# EAGLE design RP2350A_Logic_Analyzer (EAGLE 9.2.1)
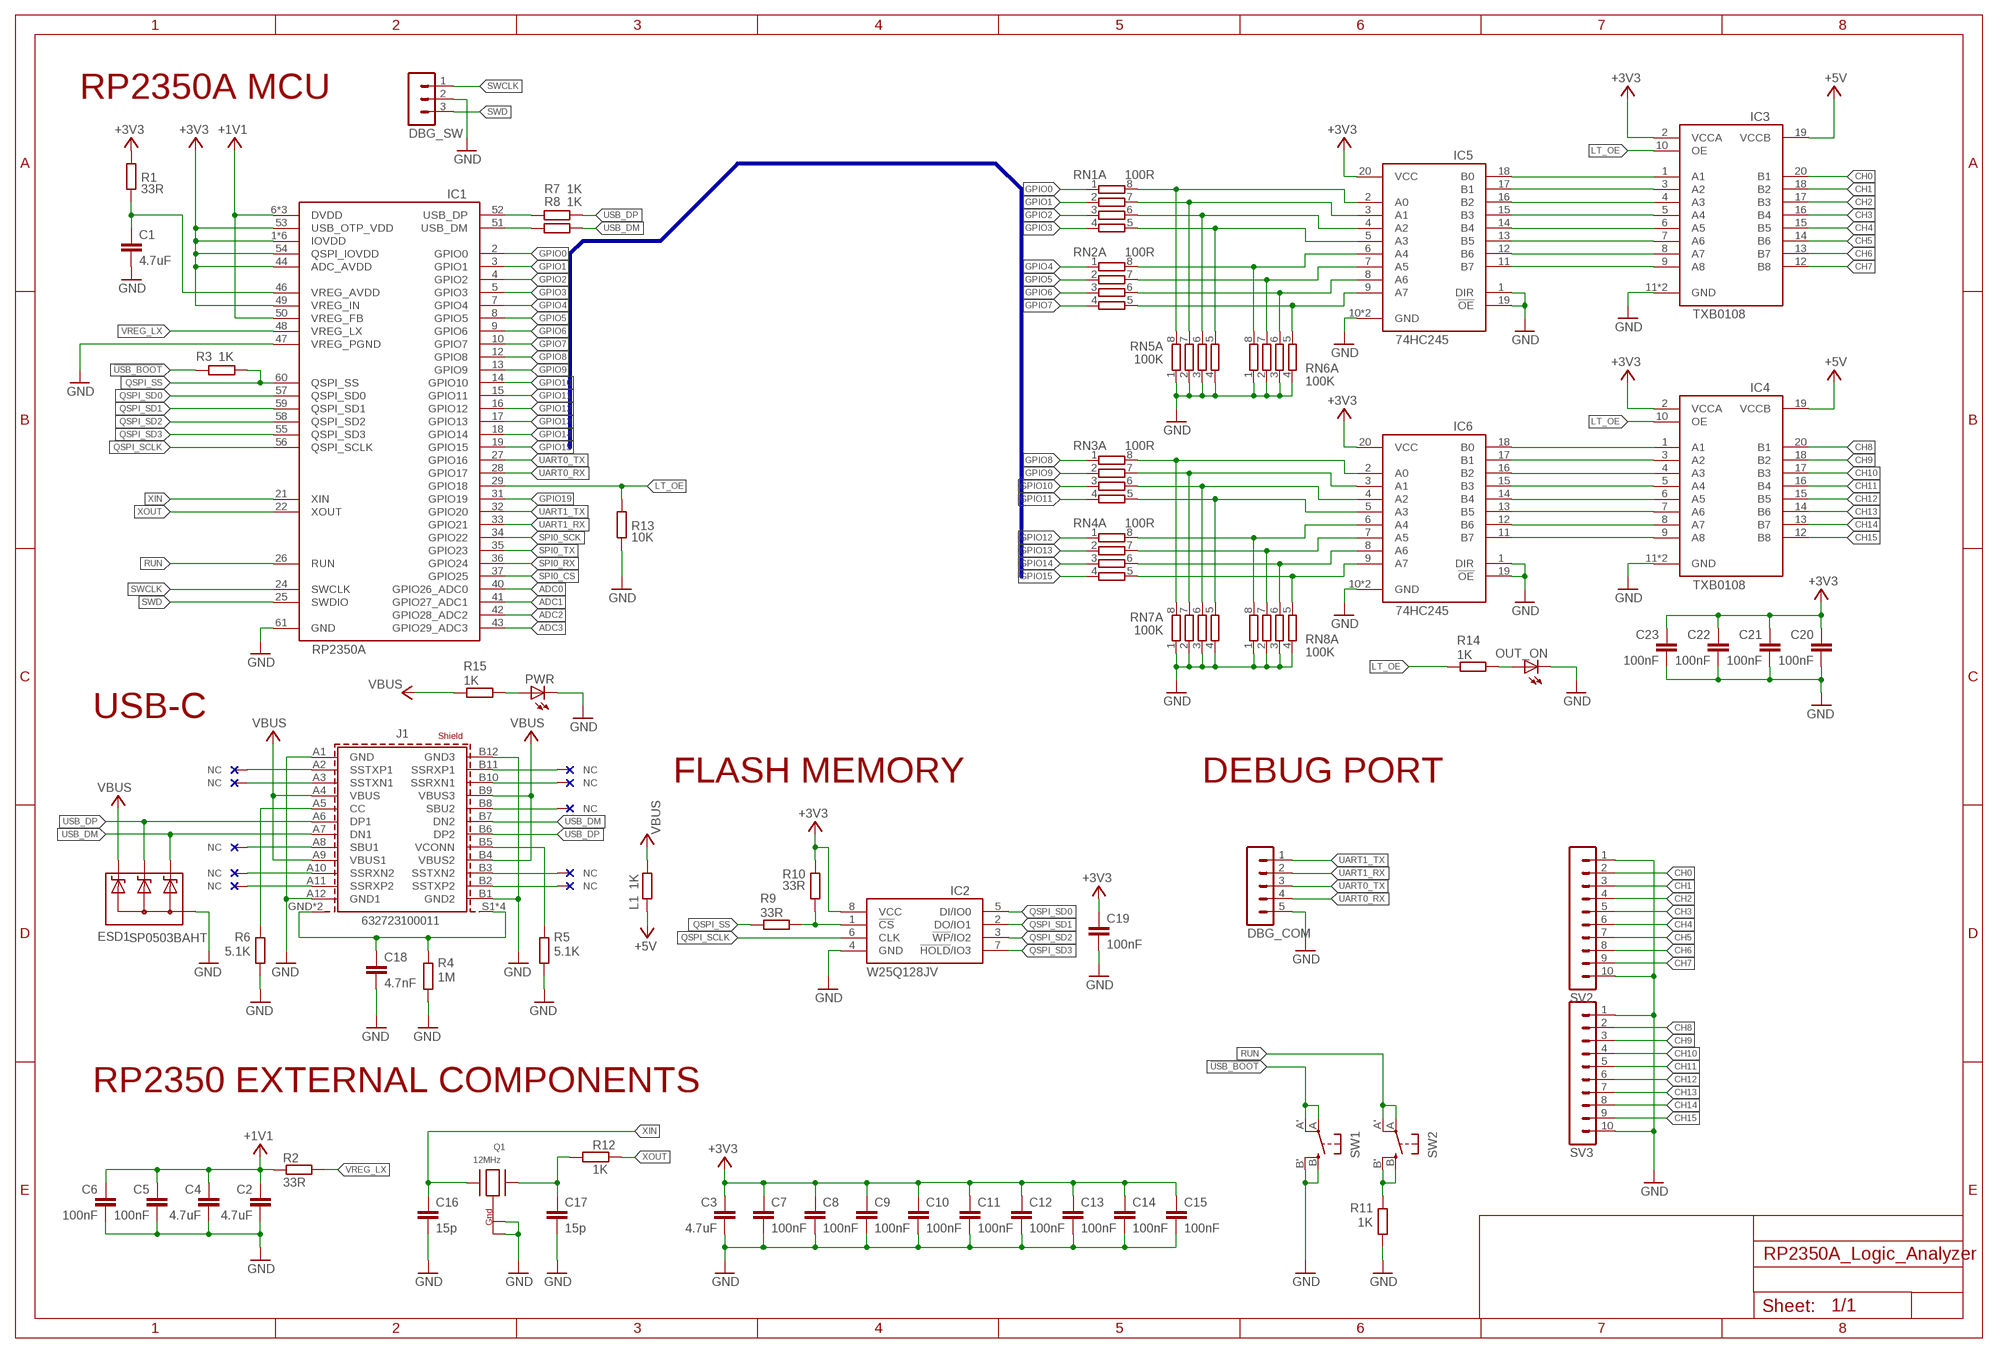
[diagram p0: schematic, sheet 1]

## Parts
C1  4.7uF  C-EUC0402  [C0402]
C2  4.7uF  C-EUC0402  [C0402]
C3  4.7uF  C-EUC0402  [C0402]
C4  4.7uF  C-EUC0402  [C0402]
C5  100nF  C-EUC0402  [C0402]
C6  100nF  C-EUC0402  [C0402]
C7  100nF  C-EUC0402  [C0402]
C8  100nF  C-EUC0402  [C0402]
C9  100nF  C-EUC0402  [C0402]
C10  100nF  C-EUC0402  [C0402]
C11  100nF  C-EUC0402  [C0402]
C12  100nF  C-EUC0402  [C0402]
C13  100nF  C-EUC0402  [C0402]
C14  100nF  C-EUC0402  [C0402]
C15  100nF  C-EUC0402  [C0402]
C16  15p  C-EUC0402  [C0402]
C17  15p  C-EUC0402  [C0402]
C18  4.7nF  C-EUC0402  [C0402]
C19  100nF  C-EUC0402  [C0402]
C20  100nF  C-EUC0402  [C0402]
C21  100nF  C-EUC0402  [C0402]
C22  100nF  C-EUC0402  [C0402]
C23  100nF  C-EUC0402  [C0402]
DBG_COM  MA05-1  [MA05-1]
DBG_SW  MA03-1  [MA03-1]
ESD1  SP0503BAHT  [SOT143]
IC1  RP2350AA  [QFN40P700X700X85-61T340N]
IC2  W25Q128JVP  [SON127P600X500X75-8N]
IC3  TXB0108RGY  [QFN50P350X450X100-25T200X300N]
IC4  TXB0108RGY  [QFN50P350X450X100-25T200X300N]
IC5  74HC245BQ  [QFN50P250X450X90-21T100X300N]
IC6  74HC245BQ  [QFN50P250X450X90-21T100X300N]
J1  632723100011  632723100011  [632723100011]
L1  1K  R-EU_R0402  [R0402]
OUT_ON  LEDCHIPLED_0603  [CHIPLED_0603]
PWR  LEDCHIPLED_0603  [CHIPLED_0603]
Q1  12MHz  XTAL-4-3225  [NX3225]
R1  33R  R-EU_R0402  [R0402]
R2  33R  R-EU_R0402  [R0402]
R3  1K  R-EU_R0402  [R0402]
R4  1M  R-EU_R0402  [R0402]
R5  5.1K  R-EU_R0402  [R0402]
R6  5.1K  R-EU_R0402  [R0402]
R7  1K  R-EU_R0402  [R0402]
R8  1K  R-EU_R0402  [R0402]
R9  33R  R-EU_R0402  [R0402]
R10  33R  R-EU_R0402  [R0402]
R11  1K  R-EU_R0402  [R0402]
R12  1K  R-EU_R0402  [R0402]
R13  10K  R-EU_R0402  [R0402]
R14  1K  R-EU_R0402  [R0402]
R15  1K  R-EU_R0402  [R0402]
RN1  100R  4R-N0603-ARC  [0603-ARC]
RN2  100R  4R-N0603-ARC  [0603-ARC]
RN3  100R  4R-N0603-ARC  [0603-ARC]
RN4  100R  4R-N0603-ARC  [0603-ARC]
RN5  100K  4R-N0603-ARC  [0603-ARC]
RN6  100K  4R-N0603-ARC  [0603-ARC]
RN7  100K  4R-N0603-ARC  [0603-ARC]
RN8  100K  4R-N0603-ARC  [0603-ARC]
SV2  MA10-1  [MA10-1]
SV3  MA10-1  [MA10-1]
SW1  SPST_TACT-EVQQ2  [EVQ-Q2]
SW2  SPST_TACT-EVQQ2  [EVQ-Q2]

## Nets
!USB_BOOT: R3.1 SW1.A'(P1) SW1.A(P)
+1V1: C2.1 C4.1 C5.1 C6.1 IC1.6(DVDD) IC1.23(DVDD) IC1.39(DVDD) IC1.50(VREG_FB) R2.2
+3V3: C3.1 C7.1 C8.1 C9.1 C10.1 C11.1 C12.1 C13.1 C14.1 C15.1 C19.1 C20.1 C21.1 C22.1 C23.1 IC1.1(IOVDD) IC1.11(IOVDD) IC1.20(IOVDD) IC1.30(IOVDD) IC1.38(IOVDD) IC1.44(ADC_AVDD) IC1.45(IOVDD) IC1.49(VREG_IN) IC1.53(USB_OTP_VDD) IC1.54(QSPI_IOVDD) IC2.8(VCC) IC3.2(VCCA) IC4.2(VCCA) IC5.20(VCC) IC6.20(VCC) R1.1 R10.1
+5V: IC3.19(VCCB) IC4.19(VCCB) L1.1
ADC0: IC1.40(GPIO26_ADC0)
ADC1: IC1.41(GPIO27_ADC1)
ADC2: IC1.42(GPIO28_ADC2)
ADC3: IC1.43(GPIO29_ADC3)
CH0: IC3.20(B1) SV2.2
CH1: IC3.18(B2) SV2.3
CH2: IC3.17(B3) SV2.4
CH3: IC3.16(B4) SV2.5
CH4: IC3.15(B5) SV2.6
CH5: IC3.14(B6) SV2.7
CH6: IC3.13(B7) SV2.8
CH7: IC3.12(B8) SV2.9
CH8: IC4.20(B1) SV3.2
CH9: IC4.18(B2) SV3.3
CH10: IC4.17(B3) SV3.4
CH11: IC4.16(B4) SV3.5
CH12: IC4.15(B5) SV3.6
CH13: IC4.14(B6) SV3.7
CH14: IC4.13(B7) SV3.8
CH15: IC4.12(B8) SV3.9
DM [DIFFPAIR]: IC1.51(USB_DM) R8.1
DP [DIFFPAIR]: IC1.52(USB_DP) R7.1
GND: C1.2 C2.2 C3.2 C4.2 C5.2 C6.2 C7.2 C8.2 C9.2 C10.2 C11.2 C12.2 C13.2 C14.2 C15.2 C16.2 C17.2 C18.2 C19.2 C20.2 C21.2 C22.2 C23.2 DBG_COM.5 DBG_SW.2 ESD1.1(A) IC1.47(VREG_PGND) IC1.61(GND) IC2.4(GND) IC3.11(GND) IC3.PAD(GND) IC4.11(GND) IC4.PAD(GND) IC5.1(DIR) IC5.10(GND) IC5.19(!OE) IC5.PAD(GND) IC6.1(DIR) IC6.10(GND) IC6.19(!OE) IC6.PAD(GND) J1.A1(GND) J1.A12(GND1) J1.B1(GND2) J1.B12(GND3) OUT_ON.C PWR.C Q1.2(G2) Q1.4(G1) R4.1 R5.1 R6.1 R11.1 R13.2 RN5.1 RN5.2 RN5.3 RN5.4 RN6.1 RN6.2 RN6.3 RN6.4 RN7.1 RN7.2 RN7.3 RN7.4 RN8.1 RN8.2 RN8.3 RN8.4 SV2.1 SV2.10 SV3.1 SV3.10 SW1.B'(S1) SW1.B(S)
GPIO0: IC1.2(GPIO0) RN1.1
GPIO1: IC1.3(GPIO1) RN1.2
GPIO2: IC1.4(GPIO2) RN1.3
GPIO3: IC1.5(GPIO3) RN1.4
GPIO4: IC1.7(GPIO4) RN2.1
GPIO5: IC1.8(GPIO5) RN2.2
GPIO6: IC1.9(GPIO6) RN2.3
GPIO7: IC1.10(GPIO7) RN2.4
GPIO8: IC1.12(GPIO8) RN3.1
GPIO9: IC1.13(GPIO9) RN3.2
GPIO10: IC1.14(GPIO10) RN3.3
GPIO11: IC1.15(GPIO11) RN3.4
GPIO12: IC1.16(GPIO12) RN4.1
GPIO13: IC1.17(GPIO13) RN4.2
GPIO14: IC1.18(GPIO14) RN4.3
GPIO15: IC1.19(GPIO15) RN4.4
GPIO19: IC1.31(GPIO19)
LT_OE: IC1.29(GPIO18) IC3.10(OE) IC4.10(OE) R13.1 R14.1
N$1: C1.1 IC1.46(VREG_AVDD) R1.2
N$2: R11.2 SW2.B'(S1) SW2.B(S)
N$3: IC4.1(A1) IC6.18(B0)
N$4: J1.B8(SBU2)
N$5: J1.A5(CC) R6.2
N$6: J1.B5(VCONN) R5.2
N$7: C18.1 J1.GND1(SHIELD) J1.GND(SHIELD) J1.S1(SHIELD1) J1.S2(SHIELD1) J1.S3(SHIELD1) J1.S4(SHIELD1) R4.2
N$8: IC4.3(A2) IC6.17(B1)
N$9: J1.A2(SSTXP1)
N$10: J1.A3(SSTXN1)
N$11: J1.A10(SSRXN2)
N$12: J1.A11(SSRXP2)
N$13: J1.A8(SBU1)
N$14: IC4.4(A3) IC6.16(B2)
N$15: J1.B11(SSRXP1)
N$16: J1.B10(SSRXN1)
N$17: J1.B3(SSTXN2)
N$18: J1.B2(SSTXP2)
N$19: IC2.1(!CS) R9.2 R10.2
N$20: IC4.5(A4) IC6.15(B3)
N$21: IC4.6(A5) IC6.14(B4)
N$22: IC4.7(A6) IC6.13(B5)
N$23: IC4.8(A7) IC6.12(B6)
N$24: IC4.9(A8) IC6.11(B7)
N$25: IC3.1(A1) IC5.18(B0)
N$26: IC3.3(A2) IC5.17(B1)
N$27: IC3.4(A3) IC5.16(B2)
N$28: IC3.5(A4) IC5.15(B3)
N$29: IC3.6(A5) IC5.14(B4)
N$30: IC3.7(A6) IC5.13(B5)
N$31: IC3.8(A7) IC5.12(B6)
N$32: IC3.9(A8) IC5.11(B7)
N$33: IC5.2(A0) RN1.8 RN5.8
N$34: IC5.3(A1) RN1.7 RN5.7
N$35: IC5.4(A2) RN1.6 RN5.6
N$36: IC5.5(A3) RN1.5 RN5.5
N$37: IC5.6(A4) RN2.8 RN6.8
N$38: IC5.7(A5) RN2.7 RN6.7
N$39: IC5.8(A6) RN2.6 RN6.6
N$40: IC5.9(A7) RN2.5 RN6.5
N$41: IC6.2(A0) RN3.8 RN7.8
N$42: IC6.3(A1) RN3.7 RN7.7
N$43: IC6.4(A2) RN3.6 RN7.6
N$44: IC6.5(A3) RN3.5 RN7.5
N$45: IC6.6(A4) RN4.8 RN8.8
N$46: IC6.7(A5) RN4.7 RN8.7
N$47: IC6.8(A6) RN4.6 RN8.6
N$48: IC6.9(A7) RN4.5 RN8.5
N$49: OUT_ON.A R14.2
N$50: PWR.A R15.2
OU: C17.1 Q1.1(X1) R12.1
QSPI_SCLK [DIFFPAIR]: IC1.56(QSPI_SCLK) IC2.6(CLK)
QSPI_SD0 [DIFFPAIR]: IC1.57(QSPI_SD0) IC2.5(DI/IO0)
QSPI_SD1 [DIFFPAIR]: IC1.59(QSPI_SD1) IC2.2(DO/IO1)
QSPI_SD2 [DIFFPAIR]: IC1.58(QSPI_SD2) IC2.3(!WP!/IO2)
QSPI_SD3 [DIFFPAIR]: IC1.55(QSPI_SD3) IC2.7(!HOLD!/IO3)
QSPI_SS [DIFFPAIR]: IC1.60(QSPI_SS) R3.2 R9.1
RUN: IC1.26(RUN) SW2.A'(P1) SW2.A(P)
SPI0_CS: IC1.37(GPIO25)
SPI0_RX: IC1.36(GPIO24)
SPI0_SCK: IC1.34(GPIO22)
SPI0_TX: IC1.35(GPIO23)
SWCLK: DBG_SW.1 IC1.24(SWCLK)
SWD: DBG_SW.3 IC1.25(SWDIO)
UART0_RX: DBG_COM.4 IC1.28(GPIO17)
UART0_TX: DBG_COM.3 IC1.27(GPIO16)
UART1_RX: DBG_COM.2 IC1.33(GPIO21)
UART1_TX: DBG_COM.1 IC1.32(GPIO20)
USB_DM [DIFFPAIR]: ESD1.2(C1) J1.A7(DN1) J1.B7(DN2) R8.2
USB_DP [DIFFPAIR]: ESD1.3(C2) J1.A6(DP1) J1.B6(DP2) R7.2
VBUS: ESD1.4(C3) J1.A4(VBUS) J1.A9(VBUS1) J1.B4(VBUS2) J1.B9(VBUS3) L1.2 R15.1
VREG_LX: IC1.48(VREG_LX) R2.1
XIN: C16.1 IC1.21(XIN) Q1.3(X2)
XOUT: IC1.22(XOUT) R12.2

## Buses
GPIO0,GPIO1,GPIO2,GPIO3,GPIO4,GPIO5,GPIO6,GPIO7,GPIO8,GPIO9,GPIO10,GPIO11,GPIO12,GPIO13,GPIO14,GPIO15

## Notes on the sheet
- RP2350A MCU
- USB-C
- FLASH MEMORY | DEBUG PORT
- RP2350 EXTERNAL COMPONENTS

## Library data of the parts
C1-C23 = rcl:C-EU: CAPACITOR, European symbol
DBG_COM = con-lstb:MA05-1: PIN HEADER; OC_FARNELL: unknown; OC_NEWARK: unknown
DBG_SW = con-lstb:MA03-1: PIN HEADER; OC_FARNELL: unknown; OC_NEWARK: unknown
ESD1 = MCU:SP0503BAHT: TVS Diode Arrays Surface Mount TVS Avalanche Diode Array
IC1 = MCU:RP2350A: RP2350 is a new family of microcontrollers from Raspberry Pi that offers significant enhancements over RP2040. Key features include: • Dual Cortex-M33 or Hazard3 processors at 150 MHz • 520 kB on-chip SRAM, in 10 independent banks • 8 kB of one-time-programmable storage (OTP) • Up to 16 MB of external QSPI flash/PSRAM via dedicated QSPI bus - Additional 16 MB flash/PSRAM accessible via optional second chip-select • On-chip switched-mode power supply to generate core voltage - Low-quiescent-current LDO mode can be enabled for sleep states • 2× on-chip PLLs for internal or external clock generation • Security features: - Optional boot signing, enforced by on-chip mask ROM, with key fingerprint in OTP - Protected OTP storage for optional boot decryption key - Global bus filtering based on Arm or RISC-V security/privilege levels - Peripherals, GPIOs and DMA channels individually assignable to security domains - Hardware mitigations for fault injection attacks - Hardware SHA-256 accelerator • Peripherals: - 2× UARTs - 2× SPI controllers - 2× I2C controllers - 24× PWM channels - USB 1.1 controller and PHY, with host and device support - 12× PIO state machines - 1× HSTX peripheral
IC2 = MCU:W25Q128JV: 3V 128M-BIT SERIAL FLASH MEMORY WITH DUAL/QUAD SPI & QPI & DTR
IC3 IC4 = MCU:TXB0108
IC5 IC6 = MCU:74HC245: Octal bus transceiver; 3-state
J1 = Eagle_WR-USB (rev22a):632723100011: WR-COM USB 3.1 Type C Receptacle Horizontal THT/SMT Kind Properties Durability:10 000 Mating cycles Connector Type:USB 3.1 Type C Gender:Receptacle Type:Horizontal General Information Operating Temperature:-40up to +105 °C Compliance:RoHS Electrical Properties Working Voltage:20V (DC) Withstanding Voltage:100V (AC) Contact Resistance:30 mΩ Material Properties Insulator Material:LCP Insulator Flammability Rating:UL94 V-0 Color:Black Contact Material:Brass Contact Plating:2µ” Gold over 30µ” Pd-Ni Contact Type:Stamped Shielding Material:Steel Shielding Plating:Matte Tin <https://www.we-online.com/catalog/media/o144501v209%20Family_WR-COM_632723x00011.jpg> Details see: https://www.we-online.com/catalog/en/COM_3_1_THR_SMT_TYPE_C_RECEPTACLE_HORIZONTAL/ Updated by Ella Wu 2021-09-28 2021 (C) Würth Elektronik; APPLICATION: USB 3.1; DATASHEET-URL: https://www.we-online.com/catalog/datasheet/632723100011 .pdf; GERDER: Receptacle; INTERFACE-TYPE: Type C; IR1: 5A; MOUNT: THR; PACKAGING: Tape and Reel; PART-NUMBER: 632723100011; PINS: 24; TYPE: Horizontal; WORKING-VOLTAGE: 20V(DC)
L1 R1-R15 = rcl:R-EU_: RESISTOR, European symbol
OUT_ON PWR = led:LED: LED OSRAM: - CHIPLED LG R971, LG N971, LY N971, LG Q971, LY Q971, LO R971, LY R971 LH N974, LH R974 LS Q976, LO Q976, LY Q976 LO Q996 - Hyper CHIPLED LW Q18S LB Q993, LB Q99A, LB R99A - SideLED LS A670, LO A670, LY A670, LG A670, LP A670 LB A673, LV A673, LT A673, LW A673 LH A674 LY A675 LS A676, LA A676, LO A676, LY A676, LW A676 LS A679, LY A679, LG A679 - Hyper Micro SIDELED® LS Y876, LA Y876, LO Y876, LY Y876 LT Y87S - SmartLED LW L88C, LW L88S LB L89C, LB L89S, LG L890 LS L89K, LO L89K, LY L89K LS L896, LA L896, LO L896, LY L896 - TOPLED LS T670, LO T670, LY T670, LG T670, LP T670 LSG T670, LSP T670, LSY T670, LOP T670, LYG T670 LG T671, LOG T671, LSG T671 LB T673, LV T673, LT T673, LW T673 LH T674 LS T676, LA T676, LO T676, LY T676, LB T676, LH T676, LSB T676, LW T676 LB T67C, LV T67C, LT T67C, LS T67K, LO T67K, LY T67K, LW E67C LS E67B, LA E67B, LO E67B, LY E67B, LB E67C, LV E67C, LT E67C LW T67C LS T679, LY T679, LG T679 LS T770, LO T770, LY T770, LG T770, LP T770 LB T773, LV T773, LT T773, LW T773 LH T774 LS E675, LA E675, LY E675, LS T675 LS T776, LA T776, LO T776, LY T776, LB T776 LHGB T686 LT T68C, LB T68C - Hyper Mini TOPLED® LB M676 - Mini TOPLED Santana® LG M470 LS M47K, LO M47K, LY M47K Source: http://www.osram.convergy.de LUXEON: - LUMILED® LXK2-PW12-R00, LXK2-PW12-S00, LXK2-PW14-U00, LXK2-PW14-V00 LXK2-PM12-R00, LXK2-PM12-S00, LXK2-PM14-U00 LXK2-PE12-Q00, LXK2-PE12-R00, LXK2-PE12-S00, LXK2-PE14-T00, LXK2-PE14-U00 LXK2-PB12-K00, LXK2-PB12-L00, LXK2-PB12-M00, LXK2-PB14-N00, LXK2-PB14-P00, LXK2-PB14-Q00 LXK2-PR12-L00, LXK2-PR12-M00, LXK2-PR14-Q00, LXK2-PR14-R00 LXK2-PD12-Q00, LXK2-PD12-R00, LXK2-PD12-S00 LXK2-PH12-R00, LXK2-PH12-S00 LXK2-PL12-P00, LXK2-PL12-Q00, LXK2-PL12-R00 Source: www.luxeon.com KINGBRIGHT: KA-3528ASYC Source: www.kingbright.com
Q1 = adafruit:XTAL-4: Classic 4-pin 3.2 x 2.5mm crystal
RN1-RN8 = resistor-NET:4R-N: Array Chip Resistor Source: RS Component / Phycomp; OC_FARNELL: unknown; OC_NEWARK: unknown
SV2 SV3 = con-lstb:MA10-1: PIN HEADER; OC_FARNELL: unknown; OC_NEWARK: unknown
SW1 SW2 = adafruit:SPST_TACT: SMT 6mm switch, EVQQ2 series http://www.ladyada.net/library/eagle

## Net classes
1 DIFFPAIR: width 0.2 mm, drill 0.2 mm, clearance 0.2 mm

## Board
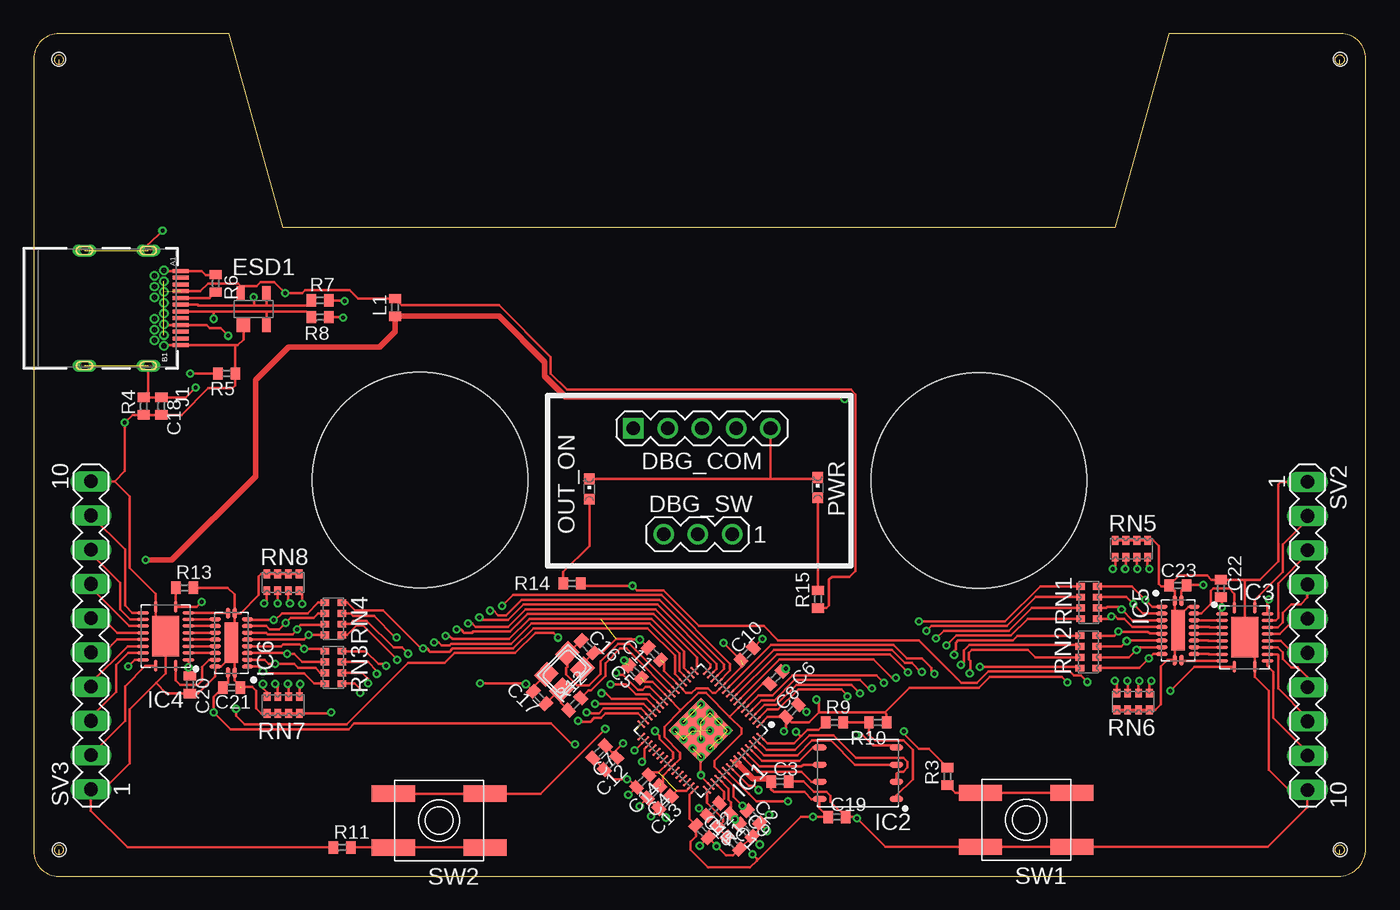
[diagram p1: board, top side]
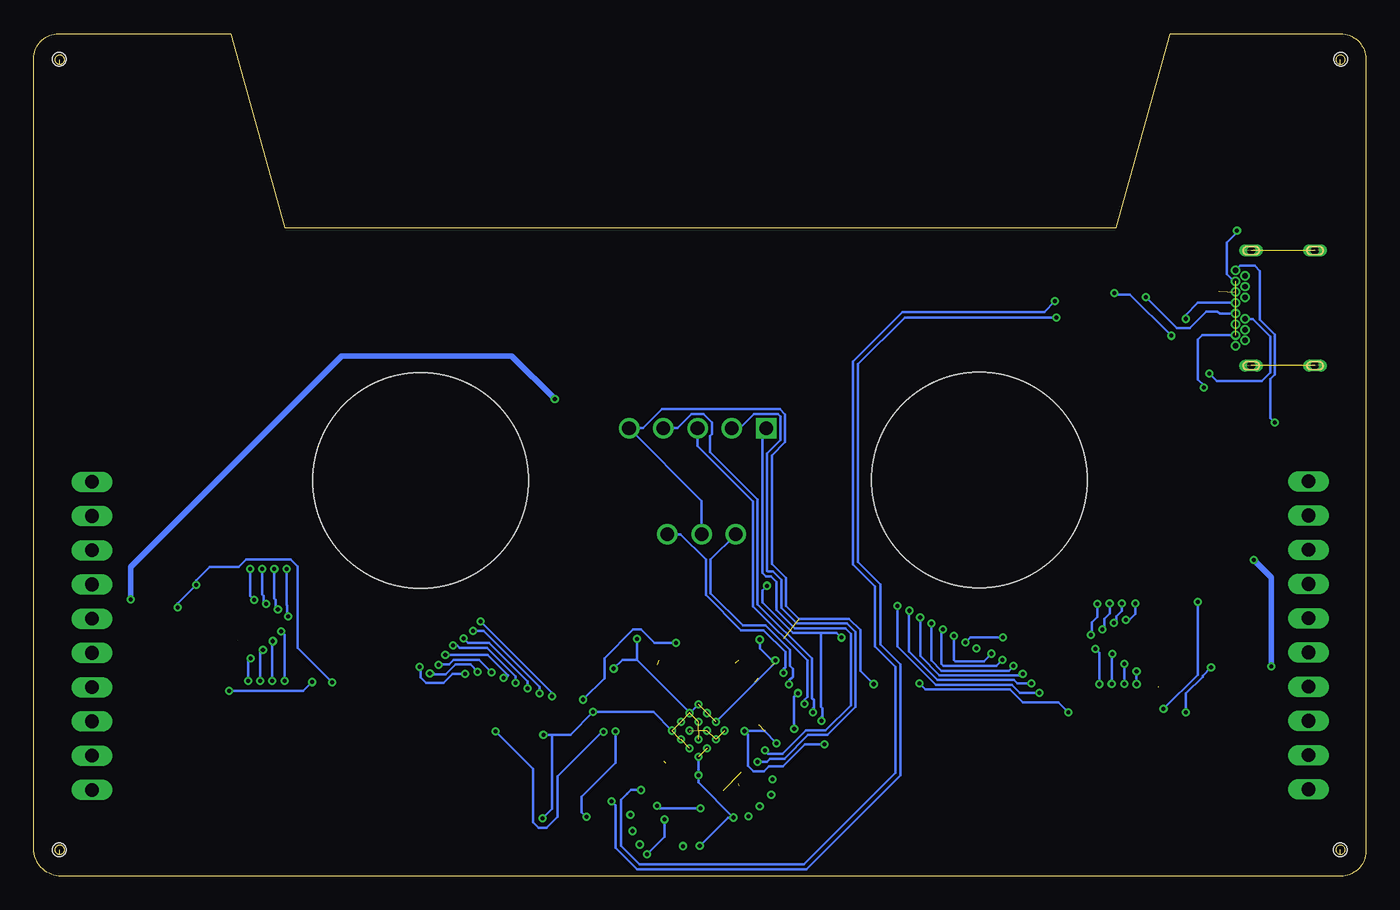
[diagram p2: board, bottom side, seen from below]

Size 98.8 x 62.5 mm. Coordinates in mm from the lower left corner, seen from the top.
Outline: 1.88,60.24 1.88,60.58
Outline: 96.88,1.62 96.88,1.96
Outline: 1.88,1.62 1.88,1.96
Outline: 96.88,60.24 96.88,60.58
Outline: 14.5,62.5 1.88,62.5 arc90 0,60.62 0,1.85 arc90 1.85,0 96.75,0 arc90 98.8,2.05 98.8,60.65 arc90 96.95,62.5 84.2,62.5 80.2,48.1 18.5,48.1 14.5,62.5
Outline: circle at 1.88,60.58 radius 0.34
Outline: circle at 96.88,1.96 radius 0.34
Outline: circle at 1.88,1.96 radius 0.34
Outline: circle at 96.88,60.58 radius 0.34
Outline: circle at 96.88,60.58 radius 0.34
Outline: circle at 1.88,1.96 radius 0.34
Outline: circle at 96.88,1.96 radius 0.34
Outline: circle at 1.88,60.58 radius 0.34
Copper layers (1*16): Top 0.035mm / dielectric 1.53mm / Bottom 0.035mm
Design rules "nyakaruhaz": minimum track width 0.15mm, minimum drill 0.3mm, track to track 0.15mm, track to pad 0.2mm, pad to pad 0.2mm, via to via 0.3mm, smd to smd 0.2mm, copper to edge 0.4mm, drill to drill 0.4mm, minimum pad ring 0.15mm, minimum via ring 0.15mm, stop-mask expansion 4mil, vias tented up to drill 4mil, thermal gap 8mil
Holes 1 mm at 1.9,1.95 1.85,60.6 96.9,1.95 96.9,60.6
Holes 16 mm at 28.65,29.4 70.1,29.35

### Footprints (pad centres in the part's own frame; a part is rotated, then mirrored left to right if it is on the bottom)
C0402 = smd 0.7 x 0.9: 1 -0.65,0; 2 0.65,0
MA05-1 = drill 1.016 square: 1 -5.08,0 | drill 1.016: 2 -2.54,0; 3 0,0; 4 2.54,0; 5 5.08,0
MA03-1 = drill 1.016: 1 -2.54,0; 2 0,0; 3 2.54,0
SOT143 = smd 1 x 1: 1 -0.75,-1.2 | smd 0.6 x 1: 2 0.95,-1.2; 3 0.95,1.2; 4 -0.95,1.2
QFN40P700X700X85-61T340N = smd 0.811 x 0.2: 1 -3.451,2.8; 2 -3.451,2.4; 3 -3.451,2; 4 -3.451,1.6; 5 -3.451,1.2; 6 -3.451,0.8; 7 -3.451,0.4; 8 -3.451,0; 9 -3.451,-0.4; 10 -3.451,-0.8; 11 -3.451,-1.2; 12 -3.451,-1.6; 13 -3.451,-2; 14 -3.451,-2.4; 15 -3.451,-2.8; 31 3.451,-2.8; 32 3.451,-2.4; 33 3.451,-2; 34 3.451,-1.6; 35 3.451,-1.2; 36 3.451,-0.8; 37 3.451,-0.4; 38 3.451,0; 39 3.451,0.4; 40 3.451,0.8; 41 3.451,1.2; 42 3.451,1.6; 43 3.451,2; 44 3.451,2.4; 45 3.451,2.8 | smd 0.2 x 0.811: 16 -2.8,-3.451; 17 -2.4,-3.451; 18 -2,-3.451; 19 -1.6,-3.451; 20 -1.2,-3.451; 21 -0.8,-3.451; 22 -0.4,-3.451; 23 0,-3.451; 24 0.4,-3.451; 25 0.8,-3.451; 26 1.2,-3.451; 27 1.6,-3.451; 28 2,-3.451; 29 2.4,-3.451; 30 2.8,-3.451; 46 2.8,3.451; 47 2.4,3.451; 48 2,3.451; 49 1.6,3.451; 50 1.2,3.451; 51 0.8,3.451; 52 0.4,3.451; 53 0,3.451; 54 -0.4,3.451; 55 -0.8,3.451; 56 -1.2,3.451; 57 -1.6,3.451; 58 -2,3.451; 59 -2.4,3.451; 60 -2.8,3.451 | smd 3.4 x 3.4: 61 0,0
SON127P600X500X75-8N = smd 1.012 x 0.432: 1 -2.85,1.905; 2 -2.85,0.635; 3 -2.85,-0.635; 4 -2.85,-1.905; 5 2.85,-1.905; 6 2.85,-0.635; 7 2.85,0.635; 8 2.85,1.905
QFN50P350X450X100-25T200X300N = smd 0.264 x 0.896: 1 -0.75,2.187; 10 -0.75,-2.187; 11 0.75,-2.187; 20 0.75,2.187 | smd 0.896 x 0.264: 2 -1.687,1.75; 3 -1.687,1.25; 4 -1.687,0.75; 5 -1.687,0.25; 6 -1.687,-0.25; 7 -1.687,-0.75; 8 -1.687,-1.25; 9 -1.687,-1.75; 12 1.687,-1.75; 13 1.687,-1.25; 14 1.687,-0.75; 15 1.687,-0.25; 16 1.687,0.25; 17 1.687,0.75; 18 1.687,1.25; 19 1.687,1.75 | smd 2 x 3: PAD 0,0
QFN50P250X450X90-21T100X300N = smd 0.282 x 0.812: 1 -0.25,2.2; 10 -0.25,-2.2; 11 0.25,-2.2; 20 0.25,2.2 | smd 0.812 x 0.282: 2 -1.2,1.75; 3 -1.2,1.25; 4 -1.2,0.75; 5 -1.2,0.25; 6 -1.2,-0.25; 7 -1.2,-0.75; 8 -1.2,-1.25; 9 -1.2,-1.75; 12 1.2,-1.75; 13 1.2,-1.25; 14 1.2,-0.75; 15 1.2,-0.25; 16 1.2,0.25; 17 1.2,0.75; 18 1.2,1.25; 19 1.2,1.75 | smd 1 x 3: PAD 0,0
632723100011 = smd 0.3 x 1.2: A1 -2.75,5.93; A2 -2.25,5.93; A3 -1.75,5.93; A4 -1.25,5.93; A5 -0.75,5.93; A6 -0.25,5.93; A7 0.25,5.93; A8 0.75,5.93; A9 1.25,5.93; A10 1.75,5.93; A11 2.25,5.93; A12 2.75,5.93 | drill 0.4 pad 0.65: B1 2.8,4.68; B2 2.4,3.98; B3 1.6,3.98; B4 1.2,4.68; B5 0.8,3.98; B6 0.4,4.68; B7 -0.4,4.68; B8 -0.8,3.98; B9 -1.2,4.68; B10 -1.6,3.98; B11 -2.4,3.98; B12 -2.8,4.68; GND 2,4.68; GND1 -2,4.68 | drill 0.6 pad 0.6 long: S1 -4.27,3.53; S2 4.27,3.53; S3 4.27,-1.2; S4 -4.27,-1.2
R0402 = smd 0.7 x 0.9: 1 -0.65,0; 2 0.65,0
CHIPLED_0603 = smd 0.8 x 0.8: A 0,-0.75; C 0,0.75
NX3225 = smd 1.4 x 1.2: 1 -1.1,-0.8; 2 1.1,-0.8; 3 1.1,0.8; 4 -1.1,0.8
0603-ARC = smd 0.5 x 0.65: 1 -1.2,-0.625; 2 -0.4,-0.625; 3 0.4,-0.625; 4 1.2,-0.625; 5 1.2,0.625; 6 0.4,0.625; 7 -0.4,0.625; 8 -1.2,0.625
MA10-1 = drill 1.016 long: 1 -11.43,0; 2 -8.89,0; 3 -6.35,0; 4 -3.81,0; 5 -1.27,0; 6 1.27,0; 7 3.81,0; 8 6.35,0; 9 8.89,0; 10 11.43,0
EVQ-Q2 = smd 3.2 x 1.2: A -3.4,-2; A' 3.4,-2; B -3.4,2; B' 3.4,2

### Placement (x,y rotation side)
C1  51.89,2.47 315 top
C2  53.38,4.41 315 top
C3  55.35,7.02 0 top
C4  45.99,6.26 225 top
C5  44.59,15.16 135 top
C6  55.04,14.74 45 top
C7  41.94,9.22 225 top
C8  56.26,12.27 45 top
C9  52.81,3.4 315 top
C10  52.91,16.49 45 top
C11  46.04,16.5 135 top
C12  42.78,8.36 225 top
C13  46.82,5.49 225 top
C14  45.17,7.06 225 top
C15  49.57,3.32 315 top
C16  41.07,17.02 315 top
C17  37.51,13.26 135 top
C18  9.47,34.87 270 top
C19  59.59,4.39 0 top
C20  11.59,14.21 270 top
C21  14.69,13.99 0 top
C22  88.06,21.34 90 top
C23  84.86,21.56 180 top
DBG_COM  49.56,33.23 0 top
DBG_SW  49.26,25.37 180 top
ESD1  16.31,42.08 0 top
IC1  49.48,10.82 225 top
IC2  61.14,7.64 180 top
IC3  89.81,17.72 0 top
IC4  9.79,17.8 180 top
IC5  84.87,18.24 0 top
IC6  14.66,17.31 180 top
J1  4.97,42.14 270 top
L1  26.8,42.2 90 top
OUT_ON  41.21,28.71 0 top
PWR  58.15,28.83 0 top
Q1  39.36,15.18 45 top
R1  51.23,4.16 225 top
R2  50.41,4.96 225 top
R3  67.77,7.42 90 top
R4  8.17,34.88 90 top
R5  14.3,37.3 180 top
R6  13.5,43.98 270 top
R7  21.24,42.72 180 top
R8  21.25,41.47 180 top
R9  59.38,11.4 0 top
R10  62.6,11.4 180 top
R11  22.89,2.13 0 top
R12  40.12,12.77 45 top
R13  11.19,21.4 0 top
R14  39.92,21.72 180 top
R15  58.17,20.55 90 top
RN1  78.27,20.3 270 top
RN2  78.22,16.64 270 top
RN3  22.23,15.49 90 top
RN4  22.23,19.1 90 top
RN5  81.41,24.29 180 top
RN6  81.54,12.96 0 top
RN7  18.51,12.7 0 top
RN8  18.49,21.8 180 top
SV2  94.47,17.83 270 top
SV3  4.24,17.87 90 top
SW1  73.61,4.18 180 top
SW2  30.07,4.13 180 top

### Tracks (layer width: path | path; a pad name or v marks a point on that pad's centre or on a via)
!USB_BOOT
  Top 0.2: R3.1 68.36,6.18 SW1.A' SW1.A
+1V1  (via drill 0.3)  (2 unrouted)
  Top 0.2: IC1.50 | IC1.50 51.9,6.7 51.9,5.9 v52.57,5.22 C2.1 | 46.54,6.86 46.67,7 46.67,7.45 IC1.39 47.95,8.72 47.95,9.15 46.77,10.33 46.77,10.94 46.79,10.96 46.79,11.09 47.95,12.25 | C6.1 54.07,14.28 IC1.6 51.65,11.86 51.65,11.8 | IC1.50 50.5,8.1 50.5,8.55 52.5,10.55 52.5,10.95 51.65,11.8 | 47.95,12.25 49.3,13.6 49.85,13.6 51.65,11.8 | IC1.23 47.95,12.35 47.95,12.25 | v49.35,5.03 49.88,4.5 R2.2
  Top 0.203: IC1.23 45.89,14.4 45.3,14.4
  Bottom 0.2: v52.57,5.22 52.38,5.03 v49.35,5.03
+3V3  (via drill 0.3)  (5 unrouted)
  Top 0.2: IC1.49 51.55,6.48 51.55,5.65 51.73,5.47 51.73,4.92 51.56,4.75 R1.1 51.69,4.52 v52,4.21 C9.1 52.27,3.78 52.75,3.78 | 46.74,15.84 46.74,15.25 IC1.20 48.39,13.6 48.8,13.6 49.16,13.95 49.99,13.95 50.35,13.6 50.56,13.6 IC1.11 52.55,15.59 52.55,15.68 | IC1.1 54.42,11.8 C8.1 | IC1.44 | IC1.44 48.7,6.65 | 48.7,6.65 48.4,6.35 47.68,6.35 C13.1 | 48.7,6.65 48.95,6.4 IC1.45 48.65,6.03 48.65,4.24 C15.1 49.11,2.95 48.7,2.54 48.7,1.96 50.01,0.65 53.14,0.65 53.64,1.15 | C14.1 45.81,7.7 46.36,7.7 IC1.38 47.4,8.74 47.4,9.21 46.42,10.18 46.42,10.41 v46.07,10.76 | C8.1 55.8,10.9 v55.65,10.75 | IC1.54 IC1.53 | 54.64,6.96 C3.1 54.7,6.45 54.9,6.25 57.15,6.25 57.7,5.7 58.29,5.7 | 58.29,5.7 58.29,5.04 C19.1 v57.8,4.4 56.89,4.4 53.64,1.15 | 58.29,5.7 IC2.8 | C8.1 56.19,11.4 57.51,11.4 58.26,12.15 | R10.1 63.25,12.02 63.12,12.15 | 63.12,12.15 58.26,12.15 | C7.1 42.89,9.19 | 42.89,9.19 43.24,8.84 C12.1 | v43.7,9.85 43.04,9.19 42.89,9.19 | v53.31,1.61 53.64,1.28 53.64,1.15 | IC6.20 14.41,14.36 C21.1 13.35,13.3 v13.35,12.15 14.6,10.9 23.34,10.9 23.77,11.33 38.37,11.33 39.93,9.77 v40.15,9.77 | IC4.2 v11.48,15.5 11.48,14.97 C20.1 | 63.12,12.15 64.96,13.98 70.11,13.98 70.91,14.79 76.26,14.79 v76.67,14.37 | v86.75,21.61 85.56,21.61 C23.1 85.12,21.17 IC5.20 | IC3.2 v88.12,19.95 88.12,20.63 C22.1 | C10.1 51.18,17.3 v51.15,17.3 | v58.05,13.1 58.26,12.89 58.26,12.15
  Top 0.406: 54.64,6.96 54.39,7.21 53.35,7.21 52.05,8.51
  Bottom 0.2: v46.07,10.76 46.05,10.76 | 46.05,10.76 44.62,10.76 v43.7,9.85 | v55.65,10.75 55.65,8.4 58.15,5.9 58.15,4.75 v57.8,4.4 | v52,4.21 52,2.92 v53.31,1.61 | v11.48,15.5 12.1,14.88 12.1,14.8 13.35,13.55 v13.35,12.15 | v40.15,9.77 41.59,9.77 43.21,8.14 44.27,8.14 44.62,7.79 45.41,7.79 45.82,8.21 45.82,10.54 46.05,10.76 | v76.67,14.37 79.23,16.93 79.23,22.97 79.76,23.5 83.04,23.5 83.59,22.95 85.75,22.95 86.75,21.95 v86.75,21.61 88.12,20.24 v88.12,19.95 | v51.15,17.3 52.76,17.3 53.76,18.3 54.34,18.3 56.48,16.16 56.48,14.67 v58.05,13.1
+5V  (via drill 0.3)
  Top 0.2: v91.6,20.54 91.5,20.44 IC3.19
  Top 0.203: IC4.19 7.49,16.05 v7,15.55
  Top 0.406: v8.3,23.45 10.25,23.45 16.45,29.65 16.45,36.8 18.9,39.25 25.65,39.25 26.8,40.4 L1.1 34.5,41.55 37.9,38.15 37.9,37.11 39.46,35.55 60,35.55 v60.15,35.4
  Bottom 0.406: v8.3,23.45 7,22.15 v7,15.55 | v60.15,35.4 63.35,38.6 75.95,38.6 91.6,22.95 v91.6,20.54
CH0
  Top 0.2: IC3.20 90.56,20.49 92.65,22.57 92.65,24.62 94.47,26.44 SV2.2
CH1
  Top 0.2: IC3.18 92.12,18.97 92.3,19.15 92.3,21.73 94.47,23.9 SV2.3
CH2
  Top 0.2: IC3.17 92.27,18.47 92.65,18.85 92.65,19.54 93.27,20.16 93.96,20.16 94.47,20.67 SV2.4
CH3
  Top 0.2: IC3.16 92.42,17.97 93.45,19 94.37,19 SV2.5
CH4
  Top 0.2: IC3.15 92.48,17.47 93.39,16.56 SV2.6
CH5
  Top 0.2: IC3.14 92.28,16.97 92.65,16.6 92.65,16.12 93.27,15.5 93.75,15.5 94.47,14.78 SV2.7
CH6
  Top 0.2: IC3.13 92.23,16.47 92.3,16.4 92.3,13.93 94.47,11.76 SV2.8
CH7
  Top 0.2: IC3.12 91.5,15.6 91.95,15.15 91.95,11.74 94.47,9.22 SV2.9
CH8
  Top 0.203: SV3.2 6.77,11.51 6.77,14.1 8.29,15.61 IC4.20
CH9
  Top 0.203: IC4.18 7,16.55 6.12,15.67 6.12,13.67 4.24,11.79 SV3.3
CH10
  Top 0.203: IC4.17 6.96,17.05 4.24,14.33 SV3.4
CH11
  Top 0.203: IC4.16 6.2,17.55 5.25,16.6 SV3.5
CH12
  Top 0.203: IC4.15 6.2,18.05 5.11,19.14 SV3.6
CH13
  Top 0.203: IC4.14 7.1,18.55 4.24,21.41 SV3.7
CH14
  Top 0.203: IC4.13 7.17,19.05 6.42,19.8 6.42,21.77 4.24,23.95 SV3.8
CH15
  Top 0.203: IC4.12 7.3,19.55 6.77,20.08 6.77,24.23 SV3.9
DM  (via drill 0.3)
  Top 0.2: R8.1 22.93,41.47 v22.95,41.45 | IC1.51 53.04,6.12 53.04,6.1 53.59,5.55 v55.95,5.55
  Bottom 0.2: v22.95,41.45 34.2,41.45 37.65,38 37.65,23.3 36,21.65 36,17.2 34.5,15.7 34.5,7.5 41.5,0.5 54.05,0.5 55.65,2.1 55.65,5.25 v55.95,5.55
DP  (via drill 0.3)
  Top 0.2: R7.1 22.98,42.72 v23.05,42.65 | IC1.52 53.04,6.69 53.44,6.69 v53.74,6.39
  Bottom 0.2: v23.05,42.65 23.85,41.85 34.37,41.85 38.05,38.17 38.05,23.13 36.4,21.48 36.4,17.03 34.9,15.53 34.9,7.67 41.66,0.9 53.88,0.9 55.25,2.27 55.25,5.65 54.8,6.1 54.51,6.39 v53.74,6.39 53.74,6.35
GND  (via drill 0.3)  (18 unrouted)
  Top 0.2: IC6.1 14.91,14.52 15.39,14.04 16.22,14.04 16.5,13.76 16.5,12.45 16.88,12.07 RN7.1 RN7.2 RN7.3 RN7.4 21.97,12.07 v22.05,12.15 | RN8.1 RN8.2 RN8.3 RN8.4 16.88,22.43 16.7,22.25 16.7,20.85 15.36,19.51 IC6.10 | 84.26,21.51 84.62,21.15 IC5.1 84.62,19.55 | 84.26,21.51 C23.2 84.96,22.31 87.04,22.31 87.36,21.99 C22.2 89.85,21.99 | RN6.1 RN6.2 RN6.3 RN6.4 83.19,12.33 83.6,12.75 83.6,15.55 84.09,16.04 IC5.10 84.62,17.99 IC5.PAD 84.62,18.49 84.62,19.55 | IC5.19 85.64,19.99 85.2,19.55 84.62,19.55 | RN5.4 RN5.3 RN5.2 RN5.1 83.04,24.91 83.45,24.5 83.45,21.7 83.64,21.51 84.26,21.51 | SV2.1 92.51,29.26 92.3,29.05 92.3,23.35 90.94,21.99 89.85,21.99 | 89.85,21.99 89.81,21.95 IC3.PAD 90.56,16.97 IC3.11 90.56,14.79 91.6,13.75 91.6,7.9 93.1,6.4 SV2.10 94.47,5.12 91.53,2.18 SW1.B SW1.B' 63.17,2.18 v61.05,4.3 60.96,4.39 C19.2 59.1,5.53 59.1,5.95 58.79,6.25 57.88,6.25 57.11,7.02 C3.2 | 9.07,14.32 7.12,12.37 7.12,8.37 5.19,6.44 SV3.1 4.24,4.86 6.97,2.13 R11.1 | 9.07,14.32 9.79,15.04 IC4.PAD | SV3.10 6,29.3 | 6,29.3 7.12,28.18 7.12,22.85 9.04,20.93 IC4.11 | IC1.47 49.45,7.45 | IC1.61 49.45,10.79 49.45,7.45 | C14.2 45.51,5.8 C4.2 | C4.2 46.3,5.03 C13.2 | C15.2 51.34,1.55 51.88,1.55 C1.2 C9.2 | C9.2 53.84,3.52 C2.2 | C14.2 44.11,7.2 v44,7.2 43.04,7.2 C12.2 | C14.2 44.16,6.05 v44.1,6.05 | C4.2 44.95,5.22 v44.95,5.2 | C13.2 45.8,4.46 v45.8,4.45 | C13.2 46.36,4.89 v46.9,4.35 | C9.2 v53.85,2.35 | C2.2 54.4,3.4 v54.4,3.35 | C2.2 53.95,3.95 v54.55,4.55 | C15.2 49.42,2.25 v49.4,2.25 | C15.2 50.64,2.26 v50.64,2.24 | 44.38,15.32 43.8,15.91 v43.8,16 | C11.2 44.99,17.55 v44.95,17.55 44.37,17.55 44.32,17.6 43.2,17.6 42.17,16.56 C16.2 40.71,15.74 Q1.2
  Top 0.2: C10.2 54.03,17.6 v54.05,17.6 | C6.2 55.71,15.4 v55.78,15.4 | 49.45,7.45 v49.5,7.5 | IC2.4 63.82,9.71 62.24,9.71 61.45,10.5 v61,10.5 | v57.31,12.19 56.77,12.73 C8.2 | 38.02,14.58 Q1.4 37.05,14 C17.2 37.03,13.72 v36.5,14.25 36.45,14.3 v33.1,14.3 | C7.2 C12.2 | C12.2 | OUT_ON.C 54.65,29.46 | 54.65,29.46 58.03,29.46 PWR.C | DBG_COM.5 54.64,29.47 54.65,29.46 | ESD1.1 15.56,39.81 15.14,39.39 14.95,39.39 | 14.95,39.39 J1.A12 9.7,39.39 J1.B1 | J1.B12 9.7,44.89 J1.A1 12.46,44.89 12.75,44.6 13.47,44.6 R6.1 | 14.95,39.39 R5.1 14.95,36.4 14.75,36.2 12.95,36.2 10.97,34.22 C18.2 R4.1 7.33,34.23 v6.75,33.65 6.75,30.05 6,29.3 | R13.2 14.4,21.4 14.91,20.89 IC6.10 | 13.91,15.56 IC6.19 13.46,14.81 12.21,13.56 C20.2 9.84,13.56 9.07,14.32
  Top 0.203: IC4.11 9.04,18.55 IC4.PAD | IC6.10 14.91,17.56 IC6.PAD 14.66,16.8 | 14.66,16.8 14.66,16.31 13.91,15.56 | IC6.1 14.91,16.55 14.66,16.8
  Bottom 0.2: v49.4,2.25 47.3,4.35 v46.9,4.35 49.5,6.95 v49.5,7.5 v49.5,8.85 | v43.8,16 44.05,16 | v48.2,11.45 43.85,15.8 44.05,16 | v44.95,17.55 44.95,16.9 44.05,16 | v54.05,17.6 54.05,16.05 | 54.05,16.05 50.12,12.12 v49.5,12.75 | v55.78,15.4 55.13,16.05 54.05,16.05 | 50.85,10.15 v50.8,10.15 | v61,10.5 60.35,10.5 | 60.35,10.5 59,10.5 v57.31,12.19 52.84,12.19 v51.45,10.8 | v61.05,4.3 60.35,5 60.35,10.5 | DBG_SW.2 49.26,27.85 DBG_COM.5 53.6,33.23 52.19,34.64 43.45,34.64 43.07,34.26 43.07,32.2 44.05,31.22 44.05,23.18 43,22.13 43,20.05 42.05,19.1 38.32,19.1 37.5,18.28 37.5,15.25 v36.5,14.25 | J1.B12 9.29,45.3 8.25,45.3 7.85,44.9 7.85,41.3 6.75,40.2 6.75,37.21 7.08,36.88 7.08,33.98 v6.75,33.65 | v22.05,12.15 22.8,12.9 25.45,12.9 26.39,13.85 32.65,13.85 v33.1,14.3
  other vias: 47.55,10.8 48.85,12.1 48.85,9.5 48.2,10.15 48.85,10.8 49.5,11.45 50.15,12.1 50.8,11.45 50.15,9.5 49.5,10.15 50.15,10.8
GPIO0  (via drill 0.3)
  Top 0.2: IC1.2 54.41,12.36 55.21,12.36 56.7,13.85 59.9,13.85 60.34,13.4 v60.34,13.35 | RN1.1 74.65,21.5 72.05,18.9 v65.65,18.9
  Bottom 0.2: v65.65,18.9 60.34,13.59 v60.34,13.35
GPIO1  (via drill 0.3)
  Top 0.2: IC1.3 54.2,12.71 55.07,12.71 56.56,14.2 60.05,14.2 60.15,14.2 60.65,14.2 v61.3,13.55 | v66.22,18.2 66.57,18.55 72.2,18.55 74.34,20.7 RN1.2
  Bottom 0.2: v61.3,13.55 61.3,14.05 65.45,18.2 v66.22,18.2
GPIO2  (via drill 0.3)
  Top 0.2: IC1.4 53.98,13.06 54.92,13.06 56.41,14.55 61.29,14.55 61.9,13.94 v62.18,13.94 | RN1.3 74.04,19.9 72.34,18.2 67.5,18.2 v66.92,17.63
  Bottom 0.2: v62.18,13.94 62.18,14.44 65.04,17.3 66.6,17.3 v66.92,17.63
GPIO3  (via drill 0.3)
  Top 0.2: IC1.5 53.77,13.41 54.78,13.41 56.27,14.9 62.5,14.9 v63.06,14.33 | RN1.4 73.73,19.1 72.48,17.85 68.42,17.85 v67.68,17.12
  Bottom 0.2: v67.68,17.12 67.4,17.12 67.21,16.93 65.16,16.93 63.06,14.83 v63.06,14.33
GPIO4  (via drill 0.3)
  Top 0.2: IC1.7 55.32,16.1 62.29,16.1 63.66,14.72 v63.95,14.72 | RN2.1 72.97,17.84 72.63,17.5 68.56,17.5 68.38,17.32 68.38,16.83 68.27,16.71 v68.27,16.43
  Bottom 0.2: v68.27,16.43 67.99,16.43 67.97,16.42 65.15,16.42 63.62,14.88 63.78,14.72 v63.95,14.72
GPIO5  (via drill 0.3)
  Top 0.2: IC1.8 55.11,16.45 63.49,16.45 v64.83,15.11 | v68.78,15.67 69,15.89 69,16.75 69.4,17.15 77.48,17.15 RN2.2
  Bottom 0.2: v64.83,15.11 65.77,16.05 67.66,16.05 67.98,15.73 68.72,15.73 v68.78,15.67
GPIO6  (via drill 0.3)
  Top 0.2: IC1.9 | IC1.9 54.89,16.8 63.64,16.8 64.63,15.81 65.12,15.81 65.76,15.17 v65.88,15.17 | RN2.3 74.31,16.24 73.75,16.8 69.6,16.8 69.35,16.55 69.35,16.09 69.48,15.96 69.48,15.38 69.35,15.25 69.35,15.1 v69.42,15.03
  Bottom 0.2: v69.42,15.03 69.14,15.03 69.07,14.97 68.25,14.97 67.52,15.7 66.41,15.7 v65.88,15.17
GPIO7  (via drill 0.3)
  Top 0.2: IC1.10 54.68,17.15 63.78,17.15 64.77,16.16 65.88,16.16 66.58,15.46 66.58,15.22 v66.8,15 | v70.18,15.54 77.49,15.54 RN2.4
  Bottom 0.2: v66.8,15 67.72,15 68.39,14.33 69.71,14.33 70.12,14.74 70.12,15.48 v70.18,15.54
GPIO8  (via drill 0.3)
  Top 0.2: IC1.12 51.65,15.25 51.65,15.75 46.55,20.85 35.55,20.85 v34.75,20.05 | v24.2,13.6 24.2,13.9 23.81,14.29 RN3.1
  Bottom 0.2: v34.75,20.05 34.75,17.05 31.9,14.2 26.25,14.2 25.65,13.6 v24.2,13.6
GPIO9  (via drill 0.3)
  Top 0.2: IC1.13 51.2,15.37 51.2,15.71 46.41,20.5 36.19,20.5 35.04,19.35 34.46,19.35 34.11,19.7 v33.85,19.7 | v24.8,14.3 24.8,14.65 24.36,15.09 RN3.2
  Bottom 0.2: v33.85,19.7 33.9,19.7 33.9,16.7 31.75,14.55 26.1,14.55 25.85,14.3 v24.8,14.3
GPIO10  (via drill 0.3)
  Top 0.2: IC1.14 50.65,15.38 50.65,15.76 46.26,20.15 36.34,20.15 35.18,19 33.25,19 v33.05,19.2 | RN3.3 24.8,15.89 25.45,15.24 v25.45,15
  Bottom 0.2: v25.45,15 25.55,14.9 31.61,14.9 33.05,16.34 v33.05,19.2
GPIO11  (via drill 0.3)
  Top 0.2: IC1.15 50.2,15.5 50.2,15.71 46.12,19.8 36.48,19.8 35.18,18.5 32.76,18.5 32.5,18.76 v32.21,18.76 | RN3.4 24.63,16.69 25.57,15.75 25.97,15.75 v26.12,15.6
  Bottom 0.2: v26.12,15.6 26.47,15.25 31.46,15.25 32.21,16 v32.21,18.76
GPIO12  (via drill 0.3)
  Top 0.2: IC1.16 49.2,15.42 49.2,16.22 45.97,19.45 36.62,19.45 35.32,18.15 32.59,18.15 32.5,18.06 31.92,18.06 31.69,18.3 v31.35,18.3 | RN4.1 23.25,17.9 23.95,18.6 24.45,18.6 26.95,16.1 v26.95,16.05
  Bottom 0.2: v26.95,16.05 27.4,15.6 31.32,15.6 31.48,15.76 31.48,18.16 v31.35,18.3
GPIO13  (via drill 0.3)
  Top 0.2: IC1.17 48.25,15.44 48.25,16.68 45.82,19.1 36.77,19.1 35.27,17.6 31.06,17.6 30.82,17.84 v30.54,17.84 | RN4.2 23.45,18.7 23.7,18.95 24.69,18.95 26.68,16.96 27.31,16.96 v27.76,16.51
  Bottom 0.2: v27.76,16.51 28.32,15.95 30.45,15.95 30.55,16.05 30.55,17.83 v30.54,17.84
GPIO14  (via drill 0.3)
  Top 0.2: IC1.18 47.9,15.22 47.9,16.53 45.68,18.75 36.91,18.75 35.41,17.25 30.94,17.25 30.83,17.14 30.25,17.14 30.04,17.35 v29.7,17.35 | RN4.3 23.5,19.5 23.7,19.3 25.24,19.3 26.82,17.72 v26.92,17.72
  Bottom 0.2: v26.92,17.72 29.33,17.72 v29.7,17.35
GPIO15  (via drill 0.3)
  Top 0.2: IC1.19 47.55,15.01 47.55,16.39 45.53,18.4 37.06,18.4 35.56,16.9 31.08,16.9 30.83,16.65 29.41,16.65 29.16,16.9 v28.9,16.9 | v28.9,16.9 v28.89,16.89 | RN4.4 23.25,20.3 23.85,19.7 25.92,19.7 28.72,16.9 v28.9,16.9
LT_OE  (via drill 0.3)
  Top 0.2: IC1.29 44.81,12.09 42.42,12.09 42.07,11.74 41.56,11.74 41.28,11.46 40.7,11.46 40.64,11.52 v40.36,11.52 | v38.9,17.7 38.55,18.05 37.2,18.05 35.7,16.55 31.23,16.55 30.49,15.81 27.76,15.81 23.2,11.25 15.65,11.25 15,11.9 v15,12.4 | v12.45,20.35 12.09,19.99 IC4.10 R13.1 | v78.15,14.4 77.66,14.89 77.15,14.89 76.84,15.19 70.82,15.19 69.96,14.33 68.82,14.33 65.65,17.5 55.2,17.5 54.15,18.55 49.34,18.55 46.7,21.2 44.75,21.2 v44.4,21.55 40.74,21.55 R14.1 | v84.3,13.75 86.08,15.53 IC3.10
  Bottom 0.2: 40.35,18.05 40.41,17.99 40.41,12.56 40.3,12.45 40.3,11.87 40.36,11.81 v40.36,11.52 | 40.35,18.05 39.25,18.05 v38.9,17.7 | v15,12.4 12.45,14.95 v12.45,20.35 | 40.35,18.05 42.48,18.05 44.75,20.32 44.75,21.2 v44.4,21.55 | v78.15,14.4 78.8,13.75 v84.3,13.75
N$1
  Top 0.2: IC1.46 49.94,5.43 51.11,4.25 51.11,4.04 R1.2 50.77,3.59 C1.1
N$2
  Top 0.2: SW2.B SW2.B' R11.2
N$3
  Top 0.2: IC6.18 13.01,16.06 12.49,15.54 12.49,14.54 12.16,14.21 10.87,14.21 10.54,14.54 IC4.1
N$5
  Top 0.2: J1.A5 13.06,42.89 R6.2
N$6  (via drill 0.3)
  Top 0.2: v11.6,37.3 R5.2
  Bottom 0.2: J1.B5 8.39,41.34 7.1,40.05 7.1,37.35 7.7,36.75 11.05,36.75 v11.6,37.3
N$7  (via drill 0.3)  (3 unrouted)
  Top 0.2: J1.S1 8.5,46.85 v9.55,47.9 | v12,36.25 11.27,35.52 C18.1 R4.2 8.5,35.86 J1.S2
  Bottom 0.2: J1.GND1 9.8,44.29 9.92,44.29 10.3,44.67 10.3,47 9.55,47.75 v9.55,47.9 | J1.GND 12.11,40.14 12.45,39.8 12.45,36.85 11.95,36.35 11.95,36.3 v12,36.25
N$8
  Top 0.203: IC4.3 IC6.17
N$14
  Top 0.203: IC6.16 IC4.4
N$19
  Top 0.2: R9.2 R10.2 61.95,10.5 62.39,10.06 64.49,10.06 65.2,9.36 65.2,7.19 63.99,5.99 IC2.1
N$20
  Top 0.203: IC4.5 IC6.15
N$21
  Top 0.203: IC6.14 IC4.6
N$22
  Top 0.203: IC4.7 IC6.13
N$23
  Top 0.203: IC6.12 IC4.8
N$24
  Top 0.203: IC4.9 14.37,19.55 IC6.11
N$25
  Top 0.2: IC5.18 86.61,19.49 87.31,20.19 87.31,21.16 87.49,21.34 88.66,21.34 89.06,20.94 IC3.1
N$26
  Top 0.2: IC5.17 87.2,18.99 87.22,18.97 IC3.3
N$27
  Top 0.2: IC5.16 87.2,18.49 87.22,18.47 IC3.4
N$28
  Top 0.2: IC5.15 87.15,17.99 87.17,17.97 IC3.5
N$29
  Top 0.2: IC3.6 87.12,17.47 87.1,17.49 IC5.14
N$30
  Top 0.2: IC3.7 87.12,16.97 87.1,16.99 IC5.13
N$31
  Top 0.2: IC3.8 87.17,16.47 87.15,16.49 IC5.12
N$32
  Top 0.2: IC3.9 85.19,15.97 IC5.11
N$33  (via drill 0.3)
  Top 0.2: RN5.8 82.61,22.94 v82.75,22.8 | IC5.2 82.96,19.99 v82.45,20.5 81.45,21.5 RN1.8
  Bottom 0.2: v82.75,22.8 82.75,20.8 v82.45,20.5
N$34  (via drill 0.3)
  Top 0.2: RN5.7 81.81,22.84 v81.85,22.8 | IC5.3 82.26,19.49 v81.55,20.2 81.05,20.7 RN1.7
  Bottom 0.2: v81.85,22.8 81.85,20.89 81.75,20.79 81.75,20.4 v81.55,20.2
N$35  (via drill 0.3)
  Top 0.2: RN5.6 81.01,22.86 v80.95,22.8 | IC5.4 81.49,18.99 v80.69,19.79 80.5,19.98 79.64,19.98 79.56,19.9 RN1.6
  Bottom 0.2: v80.95,22.8 80.95,20.59 80.85,20.49 80.85,19.95 v80.69,19.79
N$36  (via drill 0.3)
  Top 0.2: RN5.5 80.21,22.96 v80.05,22.8 | IC5.5 81.49,18.49 80.89,19.09 80.4,19.09 80.21,19.28 v79.93,19.28 79.75,19.1 RN1.5
  Bottom 0.2: v79.93,19.28 80.05,19.4 80.05,19.44 79.99,19.5 79.99,20.08 80.05,20.14 v80.05,22.8
N$37  (via drill 0.3)
  Top 0.2: RN6.8 80.34,14.36 v80.2,14.5 | IC5.6 82.77,18 82.63,18.14 v80.46,18.14 v80.45,18.15 80.14,17.84 RN2.8
  Bottom 0.2: v80.2,14.5 80.2,17.9 v80.45,18.15
N$38  (via drill 0.3)  (1 unrouted)
  Top 0.2: RN6.7 81.14,14.46 v81.1,14.5 | IC5.7 81.12,17.5 v81.06,17.44 80.66,17.04 RN2.7
  Bottom 0.2: v81.1,14.5 81.1,17.4 v81.06,17.44
N$39  (via drill 0.3)
  Top 0.2: RN6.6 81.94,14.44 v82,14.5 | IC5.8 81.99,16.99 81.83,16.82 v81.8,16.8 81.24,16.24 RN2.6
  Bottom 0.2: v82,14.5 82,16.6 v81.8,16.8
N$40  (via drill 0.3)
  Top 0.2: RN6.5 82.74,14.34 v82.9,14.5 | IC5.9 83.04,16.49 v82.7,16.15 81.99,15.44 RN2.5
  Bottom 0.2: v82.9,14.5 82.9,15.95 v82.7,16.15
N$41  (via drill 0.3)
  Top 0.2: RN7.8 17.31,13.64 17,13.95 v17,14.25 | RN3.8 20.81,14.29 20.05,15.05 17.15,15.05 v17,15.2 16.97,15.2 16.61,15.56 IC6.2
  Bottom 0.2: v17,14.25 v17,15.2
N$42  (via drill 0.3)
  Top 0.2: RN7.7 18.11,14.05 v17.9,14.26 | IC6.3 17.13,16.06 17.44,15.75 v17.9,15.75 19.3,15.75 19.6,15.45 20.9,15.45 21.26,15.09 RN3.7
  Bottom 0.2: v17.9,14.26 v17.9,15.75
N$43  (via drill 0.3)
  Top 0.2: RN7.6 18.91,14.2 v18.85,14.26 | IC6.4 18.74,16.56 v18.8,16.5 19.3,16.5 19.91,15.89 RN3.6
  Bottom 0.2: v18.8,16.5 18.85,16.45 v18.85,14.26
N$44  (via drill 0.3)
  Top 0.2: RN7.5 19.71,14.21 v19.75,14.25 | IC6.5 18.37,17.06 18.51,17.2 19.71,17.2 v20.05,16.86 21.43,16.86 RN3.5
  Bottom 0.2: v20.05,16.86 19.75,16.56 v19.75,14.25
N$45  (via drill 0.3)
  Top 0.2: RN8.8 19.9,20.96 v19.9,20.2 | IC6.6 20.06,17.56 v20.4,17.9 RN4.8
  Bottom 0.2: v19.9,20.2 19.9,19.24 20.3,18.84 20.3,18 v20.4,17.9
N$46  (via drill 0.3)
  Top 0.2: RN8.7 18.89,20.35 v19,20.24 | IC6.7 17.25,18.06 17.36,17.95 19.2,17.95 v19.55,18.3 19.55,18.39 19.81,18.65 21.55,18.65 RN4.7
  Bottom 0.2: v19,20.24 19,19.49 19.4,19.09 19.4,18.45 v19.55,18.3
N$47  (via drill 0.3)
  Top 0.2: RN8.6 18.1,21.16 v18.1,20.25 | IC6.8 17.25,18.56 17.51,18.3 18.2,18.3 v18.7,18.8 19.05,19.15 20.75,19.15 21.1,19.5 RN4.6
  Bottom 0.2: v18.1,20.25 18.1,19.69 18.5,19.29 18.5,19 v18.7,18.8
N$48  (via drill 0.3)
  Top 0.2: RN8.5 17.29,20.44 v17.1,20.25 | IC6.9 15.92,19 16.31,19 v17.8,19 17.91,19 18.41,19.5 20.31,19.5 21.11,20.3 RN4.5
  Bottom 0.2: v17.1,20.25 17.1,19.45 17.55,19 v17.8,19
N$49
  Top 0.2: OUT_ON.A 41.21,24.51 39.27,22.57 R14.2
N$50
  Top 0.2: PWR.A 58.17,28.06 R15.2
OU
  Top 0.2: 39.11,13.83 Q1.1 39.1,13.83 | 39.1,13.83 39.01,13.83 C17.1 | R12.1 39.1,12.88 39.1,13.83
QSPI_SCLK
  Top 0.2: IC1.56 53.85,8.15 56.96,8.15 57.09,8.28 IC2.6
QSPI_SD0
  Top 0.2: IC1.57 54.01,8.55 56.79,8.55 57.79,9.54 IC2.5
QSPI_SD1
  Top 0.2: IC1.59 54.33,9.36 56.45,9.36 57.55,10.46 59.3,10.46 60.98,8.79 64.49,8.79 64.8,8.49 64.8,8.06 64.49,7.76 64.16,7.76 63.99,7.59 IC2.2
QSPI_SD2
  Top 0.2: IC1.58 54.16,8.96 56.64,8.96 57.74,10.06 59.14,10.06 60.92,8.28 IC2.3
QSPI_SD3
  Top 0.2: IC1.55 53.68,7.75 56.95,7.75 57.69,7 IC2.7
QSPI_SS  (via drill 0.3)
  Top 0.2: IC1.60 54.41,9.85 56.37,9.85 56.94,10.41 | 56.94,10.41 57.38,10.86 58.19,10.86 R9.1 | R3.2 66.39,9.45 65.67,9.45 64.55,10.57 v64.55,10.76 | v56.55,10.7 56.84,10.41 56.94,10.41
  Bottom 0.2: v56.55,10.7 56.61,10.76 59.95,7.42 59.95,4.41 60.76,3.6 61.34,3.6 61.75,4.01 61.75,7.96 v64.55,10.76
RUN  (via drill 0.3)
  Top 0.2: IC1.26 45.46,13.14 42.87,13.14 42.43,13.58 v42.12,13.58 | SW2.A' SW2.A 37.58,6.13 v42.39,10.94
  Bottom 0.2: v42.39,10.94 42.39,13.3 v42.12,13.58
SWCLK  (via drill 0.3)
  Top 0.2: IC1.24 45.68,14.05 45.37,14.05 45.16,13.84 44.81,13.84 43.7,14.95 43.33,14.95 v43.19,15.09
  Bottom 0.2: v43.19,15.09 43.19,15.37 43.05,15.51 43.05,16.64 44.66,18.25 46.35,18.25 48.95,20.85 48.95,23.5 50.82,25.37 DBG_SW.1
SWD  (via drill 0.3)
  Top 0.2: IC1.25 45.68,13.49 44.66,13.49 43.92,14.23 v42.77,14.23
  Bottom 0.2: v42.77,14.23 42.77,14.51 42.49,14.8 42.49,15.38 42.7,15.59 42.7,16.79 44.52,18.6 46.2,18.6 48.6,21 48.6,23.49 DBG_SW.3
UART0_RX  (via drill 0.3)
  Top 0.2: v40.99,12.16 41.28,12.16 41.35,12.09 41.93,12.09 42.28,12.44 45.03,12.44 IC1.28
  Bottom 0.2: v40.99,12.16 40.99,12.44 40.94,12.5 40.94,13.08 41.07,13.21 41.07,16.14 45.1,20.18 45.1,27.95 48.63,31.47 48.63,32.66 48.5,32.79 48.5,33.67 49.12,34.29 50,34.29 51.06,33.23 DBG_COM.4
UART0_TX  (via drill 0.3)
  Top 0.2: IC1.27 45.24,12.79 v41.64,12.79 | v41.64,12.79
  Bottom 0.2: v41.64,12.79 41.64,13.07 41.42,13.29 41.42,16 45.45,20.03 45.45,27.8 49.56,31.91 DBG_COM.3
UART1_RX  (via drill 0.3)
  Top 0.2: IC1.33 45.29,9.46 45.29,8.66 v45.12,8.49
  Bottom 0.2: v45.12,8.49 44.41,8.49 44.18,8.72 43.13,8.72 41.38,10.47 39.92,10.47 37.85,12.55 37.85,18.13 38.46,18.75 42.19,18.75 43.35,19.91 43.35,21.98 43.96,22.6 44.35,22.6 44.4,22.64 44.4,31.36 43.42,32.34 43.42,34.12 43.59,34.29 45.37,34.29 46.43,33.23 DBG_COM.2
UART1_TX  (via drill 0.3)
  Top 0.2: IC1.32 44.59,9.32 v44.57,9.32
  Bottom 0.2: v44.57,9.32 44.32,9.07 43.27,9.07 41.53,10.82 40.07,10.82 38.2,12.69 38.2,17.99 38.61,18.4 42.34,18.4 43.7,19.77 43.7,21.84 44.11,22.25 44.5,22.25 44.75,22.5 44.75,32.96 DBG_COM.1
USB_DM  (via drill 0.3)
  Top 0.2: 17.25,41.9 13.35,41.9 | 13.35,41.9 12.21,41.9 12.2,41.89 J1.A7 | ESD1.2 17.26,41.89 17.25,41.9 | v13.35,41.35 13.35,41.9 | R8.2 20.2,41.87 20.17,41.87 20.14,41.9 17.25,41.9
  Bottom 0.2: J1.B7 12.46,42.54 13.4,41.6 13.35,41.55 v13.35,41.35
USB_DP  (via drill 0.3)
  Top 0.2: 17.3,42.34 16.35,42.34 | 16.35,42.34 12.2,42.34 12.15,42.39 J1.A6 | ESD1.3 17.26,42.38 17.3,42.34 | v16.3,42.95 16.35,42.9 16.35,42.34 | R7.2 20.21,42.34 17.3,42.34
  Bottom 0.2: J1.B6 10.84,41.74 11,41.9 11.81,41.9 13.06,40.65 14,40.65 v16.3,42.95
VBUS  (via drill 0.3)  (1 unrouted)
  Top 0.2: J1.A4 12.34,43.39 12.93,43.98 15.16,43.98 15.36,43.78 | 15.36,43.78 ESD1.4 | J1.B4 9.7,40.89 J1.A9 12.82,40.89 13.06,40.65 13.87,40.65 v14.43,40.09 | 15.36,43.78 16.54,43.78 16.84,44.08 17.82,44.08 v18.65,43.25 19.9,43.25 20.12,43.47 23.43,43.47 24.05,42.85 L1.2 27.3,42.35 34.5,42.35 38.35,38.5 38.35,37.3 39.55,36.1 60.6,36.1 60.95,35.75 60.95,22.65 60.5,22.2 59.2,22.2 59,22 59,20.1 58.8,19.9 R15.1
  Bottom 0.2: v14.43,40.09 17.49,43.15 18.55,43.15 v18.65,43.25
VREG_LX
  Top 0.2: IC1.48 51.2,6.27 51.2,5.75 R2.1
XIN
  Top 0.2: C16.1 39.65,16.52 Q1.3 39.58,15.53 39.49,15.44 39.49,14.96 40.3,14.15 41.2,14.15 42.05,14.99 42.05,15.95 43.35,17.25 44.18,17.25 44.65,16.78
  Top 0.203: 44.65,16.78 IC1.21
XOUT
  Top 0.2: R12.2 41.15,13.8 41.35,13.8 42.4,14.85 42.4,15.8 43.49,16.9 43.96,16.9 44.36,16.5
  Top 0.203: 44.36,16.5 IC1.22